# Altium schematic sheet Copy of 3.3V Buck.SchDoc
size A; SheetNumber: 2; SheetTotal: 7
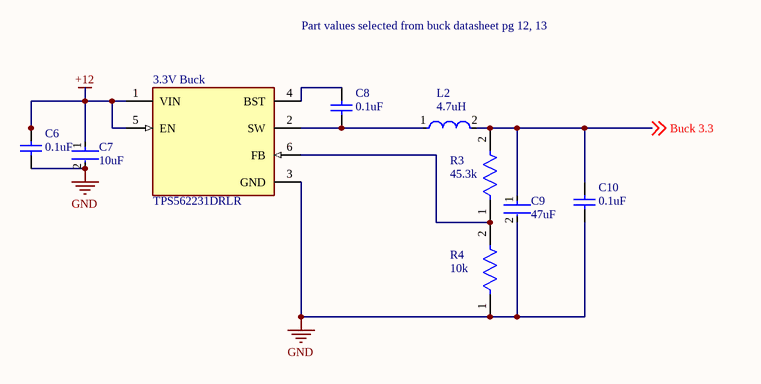
[diagram p0: Copy of 3.3V Buck.SchDoc]

## Parts
3.3V_Buck  TPS562231DRLR  [FP-DRL0006A-MFG]
C6  0.1uF  [CAPC2013X94X50LL20T25]
C7  10uF  [FP-CL21-IPC_B]
C8  0.1uF  [CAPC2013X94X50LL20T25]
C9  47uF  [FP-C3216-160-0_2-MFG]
C10  0.1uF  [CAPC2013X94X50LL20T25]
L2  4.7uH  [FP-NR8040-H_4_2-MFG]
R3  45.3k  [FP-RT0603-MFG]
R4  10k  [FP-RK73H1J-IPC_B]

## Nets
+12: 3.3V_Buck.1(VIN) 3.3V_Buck.5(EN) C6.2 C7.1
GND: 3.3V_Buck.3(GND) C6.1 C7.2 C9.2 C10.1 R4.1
Buck 3.3: C9.1 C10.2 L2.2 R3.2 ; off-sheet Buck 3.3
Net3.3V_Buck_2: 3.3V_Buck.2(SW) C8.1 L2.1
Net3.3V_Buck_4: 3.3V_Buck.4(BST) C8.2
Net3.3V_Buck_6: 3.3V_Buck.6(FB) R3.1 R4.2

## Notes on the sheet
- Part values selected from buck datasheet pg 12, 13

## Library data of the parts
3.3V_Buck = CMP-04918-000372-1: POWER MANAGEMENT
C6 C8 C10 = CMP-2007-04368-1: Part Number: 08055C104JAT4A; Manufacturer: AVX Interconnect / Elco
C7 = CMP-13271-004605-1: CL21 Series 0805 10uF 25V ±10% Tolerance X5R Multilayer Ceramic Chip Capacitor; Capacitance: 10uF; Dielectric: X5R; RoHS Compliant: Yes; Voltage Rating (DC): 25V; Case/Package: 0805; Tolerance: 10%
C9 = CMP-2000-05397-3: Multilayer Ceramic Capacitors 47uF ±20% 25V X5R SMD 1206; Weight: 0.000571oz; Dielectric: X5R; Length: 0.126inch; Voltage Rating: 25V; Case/Package: 1206; Dielectric Material: Ceramic; Min Operating Temperature: -55°C; Lead Free: Lead Free; Packaging: Tape and Reel; Package Quantity: 1; Mount: Surface Mount; Depth: 1.6mm; REACH SVHC: No SVHC; Termination: SMD/SMT; Case Code (Imperial): 1206; Series: C; Resistor Type: Ceramic; Voltage: 25V; Width: 0.063inch; Height: 1.6mm; Tolerance: 20%; Capacitance: 47uF; Max Operating Temperature: 85°C; Voltage Rating (DC): 25V; RoHS Compliant: Yes; Thickness: 0.071inch; Case Code (Metric): 3216
L2 = CMP-14484-000521-1: Shielded Wirewound Inductor 4.7uH 30% 4.1A 23.4mΩ SMD; Core Material: Ferrite; DC Resistance (DCR): 23.4mR; Test Frequency: 100kHz; Self Resonant Frequency: 30MHz; Max DC Current: 4.7A; Number of Pins: 2; Width: 0.315inch; Shielding: Shielded; Radiation Hardening: No; Min Operating Temperature: -25°C; Packaging: Tape and Reel; Max Operating Temperature: 120°C; Tolerance: 30%; Current Rating: 4.1A; Halogen Free: Halogen Free; Lead Free: Lead Free; Package Quantity: 1000; Mount: Surface Mount; RoHS Compliant: Yes; Case/Package: 3131; Inductance: 4.7uH; Saturation Current: 4.7A; Depth: 8.2mm; Length: 0.315inch; Height: 0.157inch; Termination: SMD/SMT; Series: NR
R3 = CMP-03412-027401-1: RES SMD 45.3K OHM 1% 1/10W 0603; Manufacturer: Yageo; Manufacturer Part Number: RT0603FRE0745K3L; Tolerance: 0.01; Temperature Coefficient: 50 ppm/°C; Resistance: 45.3KΩ; Power Rating: 0.1W; Voltage Rating: 75V; Value: 45.3KΩ; Temperature Range Low: -55°C; Device Class L1: Passive Components; Footprint Url: http://www.yageo.com/exep/pages/download/literatures/PYu-R_Mount_10.pdf; Ipc Land Pattern Name: RESC16080X45; Digikey Description: RES SMD 45.3K OHM 1% 1/10W 0603; Mouser Description: Thin Film Resistors - SMD 1/10W 45.3K ohm 1% 50ppm; Lead Free: Yes; Octopart: https://octopart.com/rt0603fre0745k3l-yageo-1367333; ComponentLink2Description: Datasheet; ComponentLink2URL: http://www.yageo.com/documents/recent/PYu-RT_1-to-0.01_RoHS_L_9.pdf; Composition: Thin Film; Device Class L2: Resistors; Device Class L3: Chip SMD Resistors; Temperature Range High: +155°C; Series: RT; Automotive: No; Category: Res; RoHS: TRUE; Package: RT0603; Temperature: -55°C to +155°C; Height: 0.55mm
R4 = CMP-2000-01751-2: 10kΩ ±1% 0.1W Chip Resistor 0603 Thick Film AEC-Q200 Qualified; Power Rating: 100mW; Temperature Coefficient: 100ppm/°C; Resistance: 10kR; Voltage Rating: 50V; Construction: Rectangular; Max Operating Temperature: 155°C; Resistor Type: Thick Film; Case/Package: 0603; Military Standard: MIL-R-55342F; Depth: 0.8mm; Termination: SMD/SMT; Min Operating Temperature: -55°C; RoHS Compliant: Yes; Width: 0.8mm; Length: 1.6mm; Height: 0.45mm; Case Code (Metric): 1608; Package Quantity: 10000; Lead Free: Lead Free; Series: RK73H; Packaging: Tape and Reel; Case Code (Imperial): 0603; Tolerance: 1%